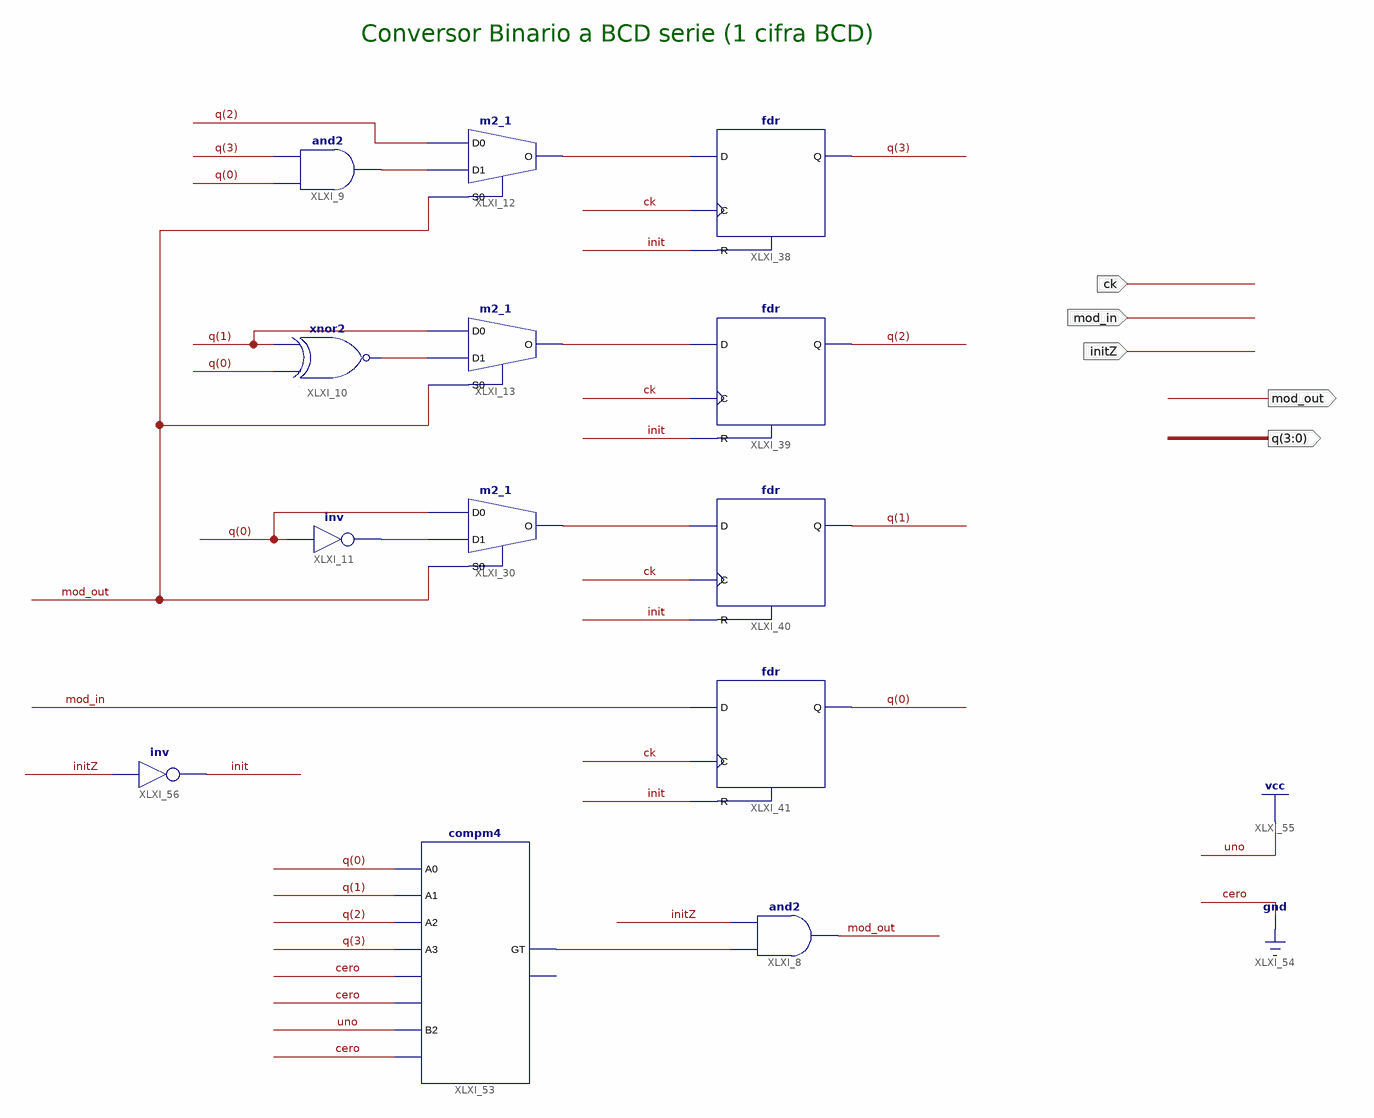
[diagram p0: schematic sheet 1]
// Xilinx ISE schematic Bin_A_BCD.sch (spartan6) as structural Verilog: 13 symbols, 5 ports
module Bin_A_BCD (
  input  initZ,
  input  ck,
  input  mod_in,
  output mod_out,
  output [3:0] q
);

  wire init, XLXN_6, XLXN_7, XLXN_8, XLXN_42, XLXN_48, XLXN_49, XLXN_50;

  fdr XLXI_39 (.C(ck), .D(XLXN_7), .R(init), .Q(q[2]));
  fdr XLXI_40 (.C(ck), .D(XLXN_8), .R(init), .Q(q[1]));
  fdr XLXI_41 (.C(ck), .D(mod_in), .R(init), .Q(q[0]));
  fdr XLXI_38 (.C(ck), .D(XLXN_6), .R(init), .Q(q[3]));
  m2_1 XLXI_13 (.D0(q[1]), .D1(XLXN_49), .S0(mod_out), .O(XLXN_7));
  m2_1 XLXI_30 (.D0(q[0]), .D1(XLXN_50), .S0(mod_out), .O(XLXN_8));
  m2_1 XLXI_12 (.D0(q[2]), .D1(XLXN_48), .S0(mod_out), .O(XLXN_6));
  compm4 XLXI_53 (
    .A0(q[0]), .A1(q[1]), .A2(q[2]), .A3(q[3]), .B0(1'b0), .B1(1'b0), .B2(1'b1), .B3(1'b0), .GT(XLXN_42));  // open: LT
  and XLXI_8 (mod_out, XLXN_42, initZ);
  not XLXI_11 (XLXN_50, q[0]);
  xnor XLXI_10 (XLXN_49, q[0], q[1]);
  and XLXI_9 (XLXN_48, q[0], q[3]);
  not XLXI_56 (init, initZ);

  // Notes on the sheet:
  //   Conversor Binario a BCD serie (1 cifra BCD)
endmodule
